# EasyEDA Pro project SICRO-Main_v2.epro

# Schematic SICRO-Main_v2
Create Date: 2023-11-26; Page Name: Main-board.SICRO-Main_v2; Project Name: LRIMa Agriculture Lite_2023-04-19_21-05-17; Schematic Name: SICRO-Main_v2; Update Date: 2024-01-04; Drawed: Nils Lahaye; Version: V1.0.0
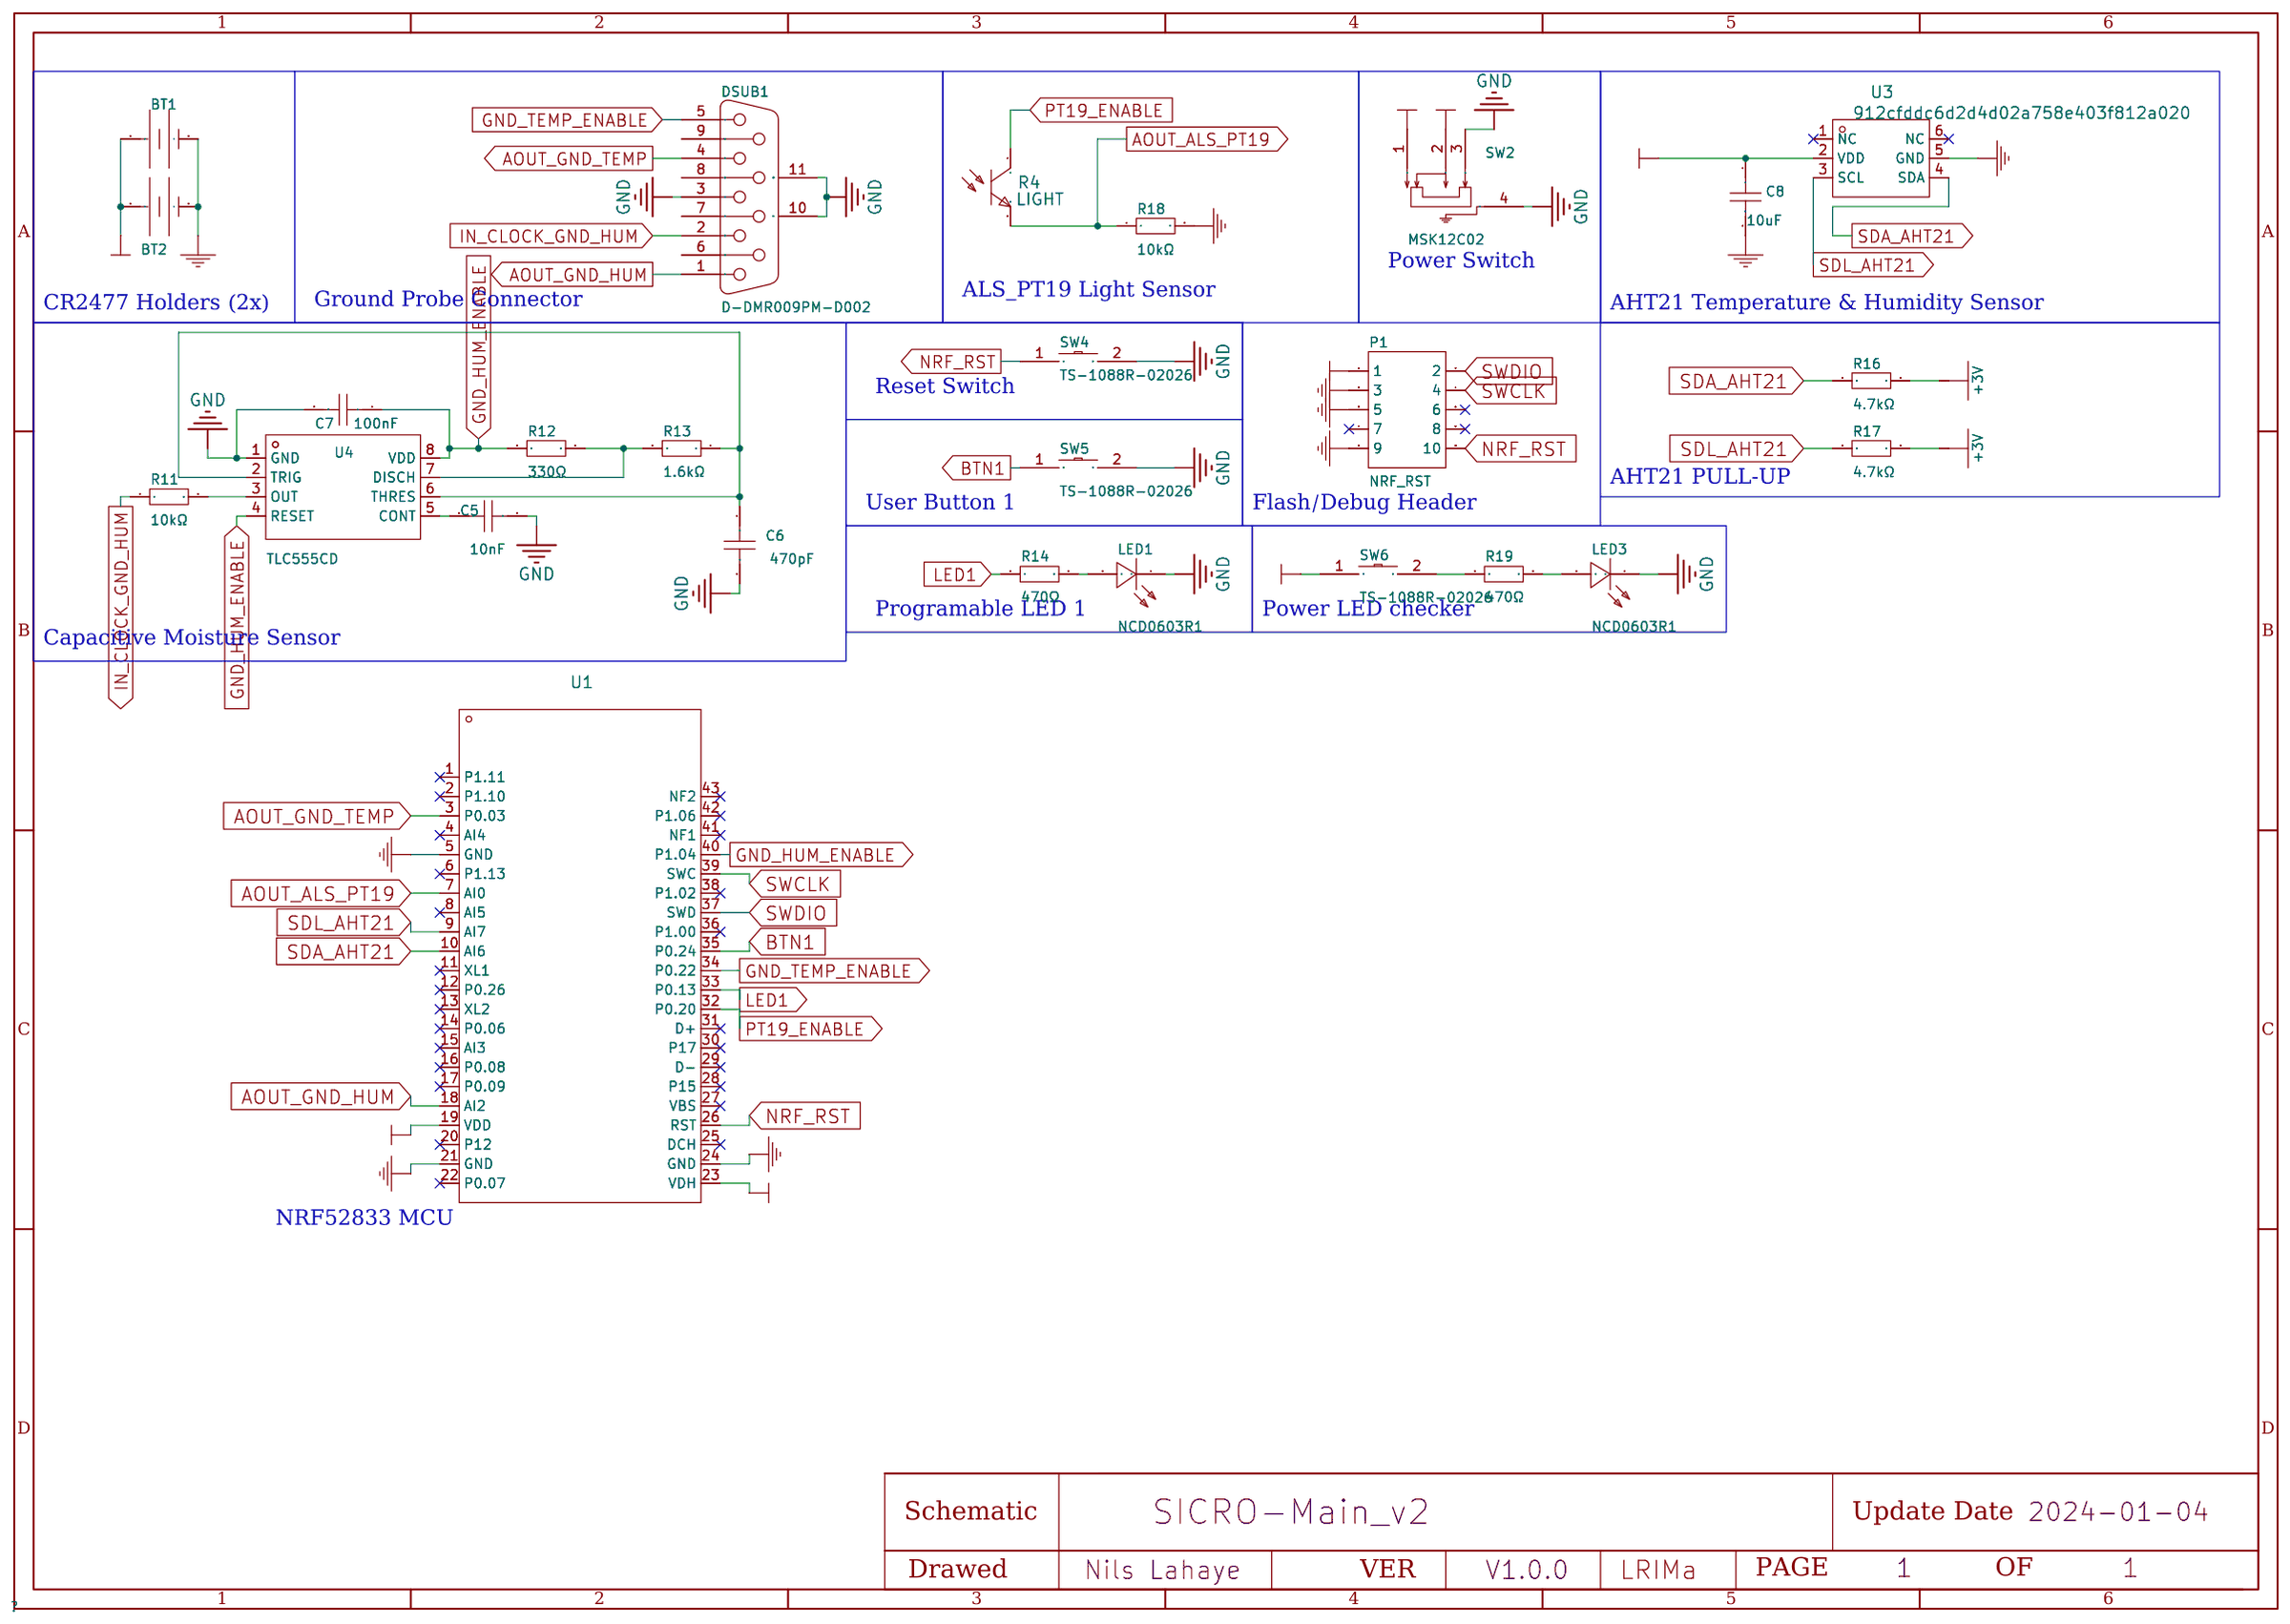
[diagram p0: schematic sheet]

## Parts
BT1  BS-24-A1AJ008  [BAT-TH_BS-24-A1AJ013]
BT2  BS-24-A1AJ008  [BAT-TH_BS-24-A1AJ013]
C5  10nF  [C0603]
C6  470pF  [C0603]
C7  100nF  [C0603]
C8  10uF  [C0603]
DSUB1  D-DMR009PM-D002  [DSUB-TH_DMR-9P]
LED1  NCD0603R1  [LED0603-RD_RED]
LED3  NCD0603R1  [LED0603-RD_RED]
P1  NRF_RST  [IDC-TH_10P-P2.54_C5665]
R4  LIGHT  [SENSORS-SMD_ALS-PT19]
R11  10kΩ  [R0603]
R12  330Ω  [R0603]
R13  1.6kΩ  [R0603]
R14  470Ω  [R0603]
R16  4.7kΩ  [R0603]
R17  4.7kΩ  [R0603]
R18  10kΩ  [R0603]
R19  470Ω  [R0603]
SW2  MSK12C02  [SW-TH_MSK12C02]
SW4  TS-1088R-02026  [SW-SMD_L3.9-W3.0-P4.45]
SW5  TS-1088R-02026  [SW-SMD_L3.9-W3.0-P4.45]
SW6  TS-1088R-02026  [SW-SMD_L3.9-W3.0-P4.45]
U1  NRF_RST  [SMD-43_L18.0-W13.0-P1.27-E73-2G4M08S1E]
U3  912cfddc6d2d4d02a758e403f812a020  [SENSOR-SMD_L3.0-W3.0-P1.00-BR]
U4  TLC555CD  [SOIC-8_L4.9-W3.9-P1.27-LS6.0-BL]

## Library data of the parts
BT1 BT2 = BS-24-A1AJ008: Connector Type:Battery base Battery Type:CR2477 Operating Temperature Range:-25℃~+85℃ Operating Temperature Range:-25℃~+85℃; LCSC Part Name: 电池底座 适用电池:CR2477; Supplier Part: C964814; Manufacturer: MYOUNG(美阳); Supplier Footprint: 插件; JLCPCB Part Class: Extended Part; Datasheet: https://atta.szlcsc.com/upload/public/pdf/source/20201218/C964814_551C7443D87E46DD8C4E7E69D648C1DE.pdf; Supplier: LCSC; Connector Type: Battery base; Battery Type: CR2477; Operating Temperature Range: -25℃~+85℃; Check: true
C5 = CC0603KRX7R9BB103: Capacitance: Tolerance:±10% Tolerance:±10% Voltage Rated: Temperature Coefficient:; LCSC Part Name: 10nF ±10% 50V; Supplier Part: C100042; Manufacturer: YAGEO(国巨); Supplier Footprint: 0603; JLCPCB Part Class: Extended Part; Datasheet: https://atta.szlcsc.com/upload/public/pdf/source/20180326/C100042_E8B0111D51DE3671A0A4A59FBCEFE81C.pdf; Supplier: LCSC; Tolerance: ±10%; Check: true
C6 = 0603B471K500NT: Capacitance: Tolerance:±10% Tolerance:±10% Voltage Rated: Temperature Coefficient:; LCSC Part Name: 470pF ±10% 50V; Supplier Part: C1620; Manufacturer: FH(风华); Supplier Footprint: 0603; JLCPCB Part Class: Basic Part; Datasheet: https://atta.szlcsc.com/upload/public/pdf/source/20170923/C1620_1506149295272988418.pdf; Supplier: LCSC; Tolerance: ±10%; Check: true
C7 = 0603B104K500NT_C30926: Capacitance: Tolerance:±10% Tolerance:±10% Voltage Rated: Temperature Coefficient:; LCSC Part Name: 100nF ±10% 50V; Supplier Part: C30926; Manufacturer: FH(风华); Manufacturer Part: 0603B104K500NT; Supplier Footprint: 0603; JLCPCB Part Class: Extended Part; Datasheet: https://atta.szlcsc.com/upload/public/pdf/source/20170923/C30926_1506149436298988724.pdf; Supplier: LCSC; Tolerance: ±10%; Check: true
C8 = CL10A106MQ8NNNC: Capacitance: Tolerance:±20% Tolerance:±20% Voltage Rated: Temperature Coefficient:; LCSC Part Name: 10uF ±20% 6.3V; Supplier Part: C1691; Manufacturer: SAMSUNG(三星); Supplier Footprint: 0603; JLCPCB Part Class: Extended Part; Datasheet: https://atta.szlcsc.com/upload/public/pdf/source/20160103/1457707690948.pdf; Supplier: LCSC; Tolerance: ±20%; Check: true
DSUB1 = D-DMR009PM-D002: Connector Type:D-Sub Gender:公 Number of Pins:9 Number of Rows:2 Mounting Style:Shrouded Current Rating (Max):3A Operating Temperature Range:-50℃~+105℃ Operating Temperature Range:-50℃~+105℃; LCSC Part Name: D-Sub 公 P数:9 DMR叉锁 半金; Supplier Part: C141880; Manufacturer: Ckmtw(灿科盟); Supplier Footprint: 插件; JLCPCB Part Class: Extended Part; Datasheet: https://atta.szlcsc.com/upload/public/pdf/source/20171123/C141880_15114109678101137623.pdf; Supplier: LCSC; Connector Type: D-Sub; Gender: 公; Number of Pins: 9; Number of Rows: 2; Mounting Style: Shrouded; Current Rating (Max): 3A; Operating Temperature Range: -50℃~+105℃; Check: true
LED1 LED3 = NCD0603R1_C84263: Emitted Color:红灯; LCSC Part Name: 红灯; Supplier Part: C84263; Manufacturer: 国星光电; Supplier Footprint: 0603; JLCPCB Part Class: Extended Part; Datasheet: https://atta.szlcsc.com/upload/public/pdf/source/20200820/C84263_DABC6A75E58F576973B407FDBA283D60.pdf; Supplier: LCSC; Emitted Color: 红灯; Operating Temperature: -40℃~+85℃; Check: true
P1 = 2.54-2*5P简牛: Connector Type:简牛座 Pin Number in each Row:5 Number of Rows:2 Pitch:2.54mm Row Spacing:2.54mm Holder Type:Straight Contact Material:- Contact Plating:-; LCSC Part Name: 每排P数:5 排数:2 2.54mm; Supplier Part: C5665; Manufacturer: BOOMELE(博穆精密); Supplier Footprint: 插件,P=2.54mm; JLCPCB Part Class: Extended Part; Datasheet: https://atta.szlcsc.com/upload/public/pdf/source/20140331/1457707037896.pdf; Supplier: LCSC; Connector Type: 简牛座; Pin Number in each Row: 5; Number of Rows: 2; Pitch: 2.54mm; Row Spacing: 2.54mm; Holder Type: Straight; Check: true
R4 = ALS-PT19-315C/L177/TR8: Supplier: LCSC; Manufacturer: EVERLIGHT(亿光); Supplier Part: C146233; JLCPCB Part Class: Extended Part; Check: true
R11 R18 = 0603WAF1002T5E: Type:Thick Film Resistors Resistance: Tolerance:±1% Tolerance:±1% Power(Watts): Temperature Coefficient:±100ppm/℃ Temperature Coefficient:±100ppm/℃ Overload Voltage (Max): Operating Temperature Range:-55℃~+155℃ Operating Temperature Range:-55℃~+155℃; LCSC Part Name: 厚膜电阻 10kΩ ±1% 100mW; Supplier Part: C25804; Manufacturer: UNI-ROYAL(厚声); Supplier Footprint: 0603; JLCPCB Part Class: Basic Part; Datasheet: https://atta.szlcsc.com/upload/public/pdf/source/20200306/C422600_1E6D84923E4A46A82E41ADD87F860B5C.pdf; Supplier: LCSC; Type: Thick Film Resistors; Tolerance: ±1%; Temperature Coefficient: ±100ppm/℃; Operating Temperature Range: -55℃~+155℃; Check: true
R12 = SCR0603F330R: Resistance: Tolerance:±1% Tolerance:±1%; LCSC Part Name: 330Ω ±1%; Supplier Part: C3016255; Manufacturer: VO(翔胜); Supplier Footprint: 0603; JLCPCB Part Class: Extended Part; Datasheet: https://atta.szlcsc.com/upload/public/pdf/source/20220513/247AF9639BA21CF93567DC289CCC6A22.pdf; Supplier: LCSC; Tolerance: ±1%; Check: true
R13 = 0603WAF1601T5E: Type:Thick Film Resistors Resistance: Tolerance:±1% Tolerance:±1% Power(Watts): Temperature Coefficient:±100ppm/℃ Temperature Coefficient:±100ppm/℃ Overload Voltage (Max): Operating Temperature Range:-55℃~+155℃ Operating Temperature Range:-55℃~+155℃; LCSC Part Name: 1.6kΩ ±1% 100mW; Supplier Part: C22847; Manufacturer: UNI-ROYAL(厚声); Supplier Footprint: 0603; JLCPCB Part Class: Extended Part; Datasheet: https://atta.szlcsc.com/upload/public/pdf/source/20200306/C422600_1E6D84923E4A46A82E41ADD87F860B5C.pdf; Supplier: LCSC; Type: Thick Film Resistors; Tolerance: ±1%; Temperature Coefficient: ±100ppm/℃; Operating Temperature Range: -55℃~+155℃; Check: true
R14 R19 = 0603WAF4700T5E: Type:Thick Film Resistors Resistance: Tolerance:±1% Tolerance:±1% Power(Watts): Temperature Coefficient:±100ppm/℃ Temperature Coefficient:±100ppm/℃ Overload Voltage (Max): Operating Temperature Range:-55℃~+155℃ Operating Temperature Range:-55℃~+155℃; LCSC Part Name: 470Ω ±1% 100mW; Supplier Part: C23179; Manufacturer: UNI-ROYAL(厚声); Supplier Footprint: 0603; JLCPCB Part Class: Basic Part; Datasheet: https://atta.szlcsc.com/upload/public/pdf/source/20200306/C422600_1E6D84923E4A46A82E41ADD87F860B5C.pdf; Supplier: LCSC; Type: Thick Film Resistors; Tolerance: ±1%; Temperature Coefficient: ±100ppm/℃; Operating Temperature Range: -55℃~+155℃; Check: true
R16 R17 = FRC0603J472 TS: Type:Thick Film Resistors Resistance: Tolerance:±5% Tolerance:±5% Power(Watts): Temperature Coefficient:±100ppm/℃ Temperature Coefficient:±100ppm/℃ Overload Voltage (Max): Operating Temperature Range:-55℃~+155℃ Operating Temperature Range:-55℃~+155℃; LCSC Part Name: 4.7kΩ ±5% 100mW; Supplier Part: C2907166; Manufacturer: FOJAN(富捷); Supplier Footprint: 0603; JLCPCB Part Class: Extended Part; Datasheet: https://atta.szlcsc.com/upload/public/pdf/source/20211102/08480A48F159CF742D398A1E4DC90941.pdf; Supplier: LCSC; Type: Thick Film Resistors; Tolerance: ±5%; Temperature Coefficient: ±100ppm/℃; Operating Temperature Range: -55℃~+155℃; Check: true
SW2 = MSK12C02: LCSC Part Name: 两档侧拨贴片 7脚 拨动 白柄 柄长1.5mm,带定位柱; Supplier Part: C431540; Manufacturer: SHOU HAN(首韩); Supplier Footprint: SMD; JLCPCB Part Class: Extended Part; Supplier: LCSC; Check: true
SW4-SW6 = TS-1088R-02026: Contact Current:50mA Voltage Rating (DC):12V Circuit:SPST Mounting Style:Brick nogging Actuator Style:Round Button With Lamp:- Mechanical Life:- Switch Length:3.9mm Switch Width:2.93mm Switch Height:2mm; LCSC Part Name: 3.9*2.93*2mm 立贴 轻触开关; Supplier Part: C318938; Manufacturer: XUNPU(讯普); Supplier Footprint: SMD,3x4mm; JLCPCB Part Class: Extended Part; Datasheet: https://atta.szlcsc.com/upload/public/pdf/source/20191118/C455280_718CC4284DAF75EEB0AC8229AE7E40C5.pdf; Supplier: LCSC; Contact Current: 50mA; Voltage Rating (DC): 12V; Circuit: SPST; Mounting Style: Brick nogging; Actuator Style: Round Button; Switch Length: 3.9mm; Switch Width: 2.93mm; Switch Height: 2mm; Actuator/Cap Color: 白色带淡绿; Operating Force: 260gf; Operating Temperature: -30℃~+85℃; Strike Gundam: NO; Check: true
U1 = E73-2G4M08S1E: Supplier: LCSC; Supplier Part: C2845026; Manufacturer: null; JLCPCB Part Class: Extended Part; Check: true
U3 = AHT21: Supplier: LCSC; Supplier Part: C2827328; Manufacturer: 广州奥松; JLCPCB Part Class: Extended Part; Check: true
U4 = TLC555CD: Supply Voltage:2V~15V Supply Voltage:2V~15V Supply Current:360uA Operating Temperature:0℃~+70℃ Operating Temperature:0℃~+70℃; LCSC Part Name: 2V~15V; Supplier Part: C1520195; Manufacturer: TI(德州仪器); Supplier Footprint: SOIC-8; JLCPCB Part Class: Extended Part; Datasheet: https://atta.szlcsc.com/upload/public/pdf/source/20230221/BE785C34ED0C575E6FD643CACC9A1BDA.pdf; Supplier: LCSC; Supply Voltage: 2V~15V; Supply Current: 360uA; Operating Temperature: 0℃~+70℃; Check: true

## Nets
+3V: C8.1 P1.1 R16.2 R17.2 SW2.2 SW6.1 U1.19(VDD) U1.23(VDH) U3.2(VDD)
+3V_S: BT1.1(+) BT2.1(+) SW2.1
GND: BT1.2(-) BT2.2(-) C5.1 C6.2 C7.2 C8.2 DSUB1.3 DSUB1.10(MH1) DSUB1.11(MH2) LED1.1(K) LED3.1(K) P1.3 P1.5 P1.9 R18.2 SW2.3 SW2.4 SW4.2 SW5.2 U1.5(GND) U1.21(GND) U1.24(GND) U3.5(GND) U4.1(GND)
GND_HUM_ENABLE: C7.1 R12.2 U1.40(P1.04) U4.4(RESET) U4.8(VDD)
GND_TEMP_ENABLE: DSUB1.5 U1.34(P0.22)
AOUT_ALS_PT19: R4.2 R18.1 U1.7(AI0)
AOUT_GND_HUM: DSUB1.1 U1.18(AI2)
AOUT_GND_TEMP: DSUB1.4 U1.3(P0.03)
BTN1: SW5.1 U1.35(P0.24)
IN_CLOCK_GND_HUM: DSUB1.2 R11.1
LED1: R14.1 U1.33(P0.13)
NRF_RST: P1.10 SW4.1 U1.26(RST)
PT19_ENABLE: R4.1 U1.32(P0.20)
SDA_AHT21: R16.1 U1.10(AI6) U3.4(SDA)
SDL_AHT21: R17.1 U1.9(AI7) U3.3(SCL)
SWCLK: P1.4 U1.39(SWC)
SWDIO: P1.2 U1.37(SWD)
$1N17890: C5.2 U4.5(CONT)
$1N18073: R12.1 R13.2 U4.7(DISCH)
$1N18188: R11.2 U4.3(OUT)
$1N18552: C6.1 R13.1 U4.2(TRIG) U4.6(THRES)
$1N21950: LED1.2(A) R14.2
$1N44585: R19.1 SW6.2
$1N44588: LED3.2(A) R19.2

Not connected (* = marked no-connect by the designer): DSUB1 6 7 8 9; P1 6* 7* 8*; U1 1(P1.11)* 2(P1.10)* 4(AI4)* 6(P1.13)* 8(AI5)* 11(XL1)* 12(P0.26)* 13(XL2)* 14(P0.06)* 15(AI3)* 16(P0.08)* 17(P0.09)* 20(P12)* 22(P0.07)* 25(DCH)* 27(VBS)* 28(P15)* 29(D-)* 30(P17)* 31(D+)* 36(P1.00)* 38(P1.02)* 41(NF1)* 42(P1.06)* 43(NF2)*; U3 1(NC)* 6(NC)*

## Notes on the sheet
- Power Switch
- CR2477 Holders (2x)
- Ground Probe Connector
- ALS_PT19 Light Sensor
- AHT21 Temperature & Humidity Sensor
- Reset Switch
- AHT21 PULL-UP
- User Button 1
- Flash/Debug Header
- Programable LED 1
- Power LED checker
- Capacitive Moisture Sensor
- NRF52833 MCU

# Board SICRO-Main-PCB_v2
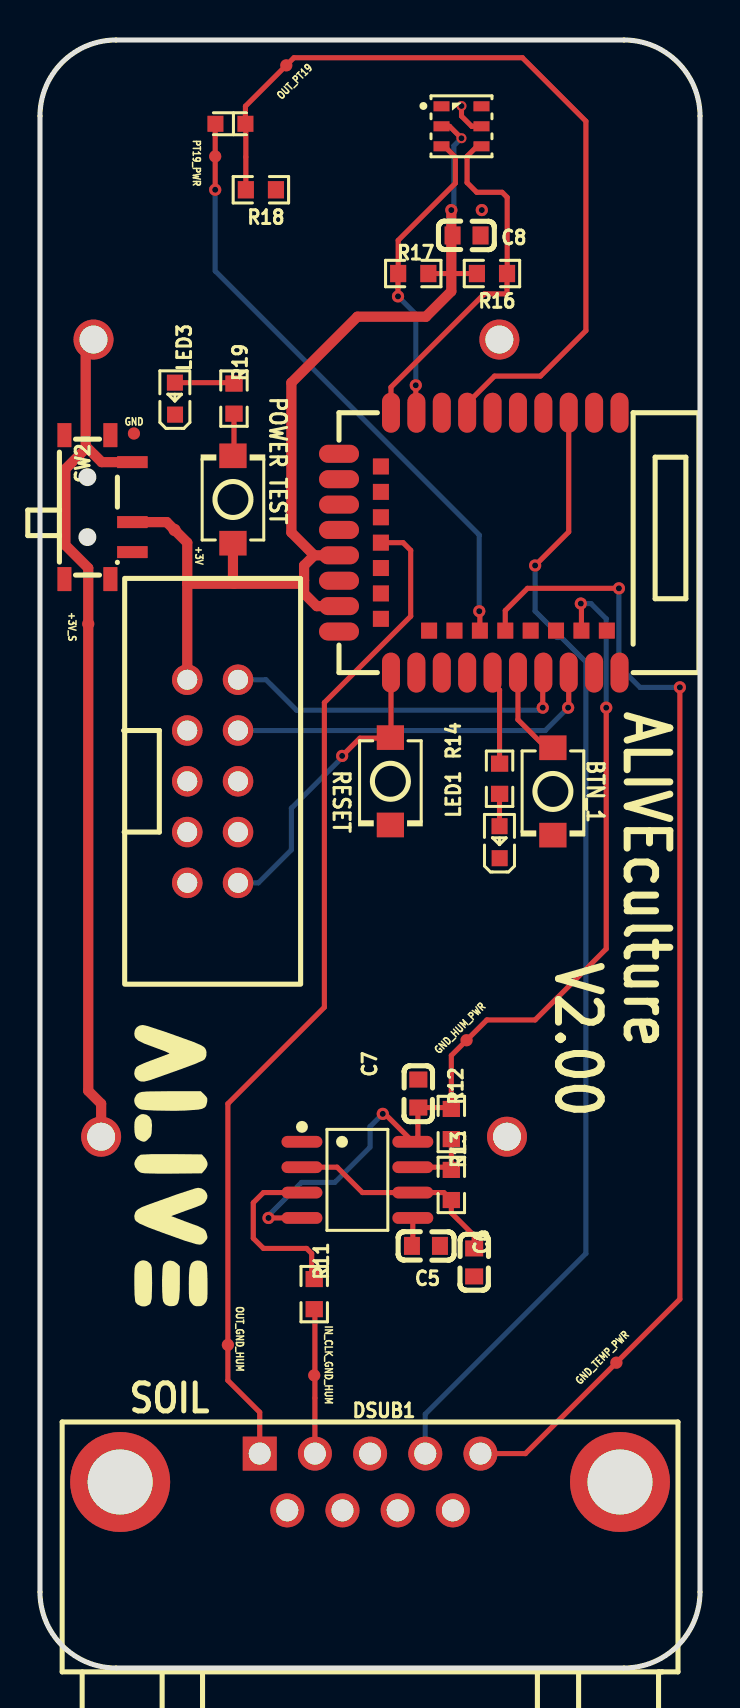
[diagram p1: board, top side]
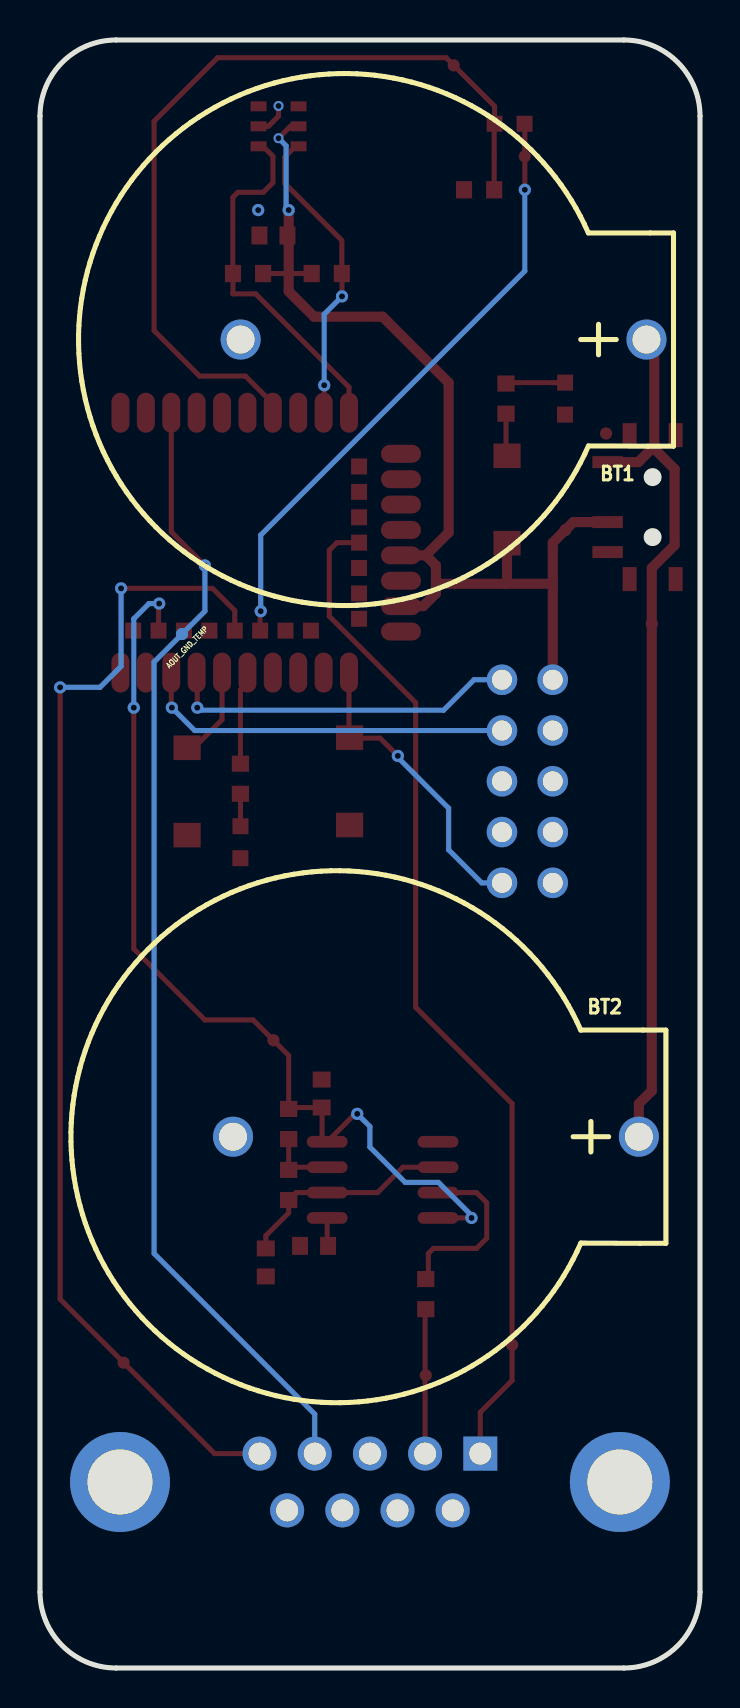
[diagram p2: board, bottom side, seen from below]

Outline 33.01 x 81.44 mm; copper layers: Top Layer, Bottom Layer. Coordinates in mm from the lower left corner of the outline.
Outline path: 0,77.63 0,3.81 arc(1.12,1.12) 3.81,0 29.2,0 arc(31.9,1.12) 33.01,3.81 33.01,77.63 arc(31.9,80.33) 29.2,81.44 3.81,81.44 arc(1.12,80.33) 0,77.63
Stack: Top Layer 0.035mm / Dielectric1 1.51mm FR4 er 4.5 / Bottom Layer 0.035mm

## Design rules (mm)
spacing safeClearance (default): track to track 0.254, other pairs 0.254 to 0.3
track width trackWidth (default): min 0.127, default 0.254, max 2.54
differential pair differentialPair (default): width min 0.127, default 0.254, max 2.54; gap min 0.152, default 0.152
via viaSize (default): diameter min 0.5, default 0.61, max 10; hole min 0.3, default 0.305, max 6

## Placement (name value [footprint] x y rotation side)
BT1  BS-24-A1AJ008  [BAT-TH_BS-24-A1AJ013]  12.83 66.46 180 bottom
BT2  BS-24-A1AJ008  [BAT-TH_BS-24-A1AJ013]  13.21 26.58 180 bottom
C5  10nF  [C0603]  19.3 21.12 180 top
C6  470pF  [c0603]  21.72 20.29 270 top
C7  100nF  [C0603]  18.92 28.74 90 top
C8  10uF  [C0603]  21.34 71.66 0 top
DSUB1  D-DMR009PM-D002  [DSUB-TH_DMR-9P]  16.51 9.31 270 top
LED1  NCD0603R1  [LED0603-RD_RED]  22.99 41.31 90 top
LED3  NCD0603R1  [LED0603-RD_RED]  6.75 63.5 90 top
NOREF  -  [Pad_e1228]  6.73 56.93 0 top
NOREF#2  -  [Pad_e1235]  12.32 80.17 0 top
NOREF#3  -  [Pad_e1253]  9.4 16.16 0 top
NOREF#4  -  [Pad_e1741]  4.7 61.76 0 top
NOREF#5  -  [Pad_e1391]  2.41 52.23 0 top
NOREF#6  -  [Pad_e1247]  13.72 14.64 0 top
NOREF#7  -  [Pad_e1259]  28.83 15.28 0 top
NOREF#8  -  [Pad_e1241]  21.34 31.4 0 top
NOREF#9  -  [Pad_e1398]  25.91 51.72 0 top
NOREF#10  -  [Pad_e1229]  8.76 75.62 0 top
P1  NRF_RST  [IDC-TH_10P-P2.54_C5665]  8.64 44.36 270 top
R1  LIGHT  [SENSORS-SMD_ALS-PT19]  9.53 77.25 0 top
R11  10kΩ  [R0603]  13.72 18.7 90 top
R12  330Ω  [R0603]  20.57 27.21 90 top
R13  1.6kΩ  [R0603]  20.57 24.17 90 top
R14  470Ω  [R0603]  22.99 44.49 270 top
R16  4.7kΩ  [R0603]  22.61 69.76 180 top
R17  4.7kΩ  [R0603]  18.67 69.76 0 top
R18  10kΩ  [R0603]  11.05 73.95 0 top
R19  470Ω  [R0603]  9.7 63.5 90 top
SW2  MSK12C02  [SW-TH_MSK12C02]  2.92 58.07 270 top
SW4  TS-1088R-02026  [SW-SMD_L3.9-W3.0-P4.45]  17.53 44.36 270 top
SW5  TS-1088R-02026  [SW-SMD_L3.9-W3.0-P4.45]  25.65 43.85 270 top
SW6  TS-1088R-02026  [SW-SMD_L3.9-W3.0-P4.45]  9.65 58.46 90 top
U1  NRF_RST  [SMD-43_L18.0-W13.0-P1.27-E73-2G4M08S1E]  21.97 56.3 90 top
U3  912cfddc6d2d4d02a758e403f812a020  [SENSOR-SMD_L3.0-W3.0-P1.00-BR]  21.08 77.12 180 top
U4  TLC555CD  [SOIC-8_L4.9-W3.9-P1.27-LS6.0-BL]  15.88 24.42 270 top

## Footprints (pads in the part's own frame, mm; a bottom-side part is the same pattern mirrored in y, then rotated)
BAT-TH_BS-24-A1AJ013
  round 2 hole 1.4: 1(10.15,0) 2(-10.15,0)
c0603
  rect 0.8x0.9 smd: 1(-0.7,0) 2(0.7,0)
C0603
  rect 0.8x0.9 smd: 1(-0.7,0) 2(0.7,0)
DSUB-TH_DMR-9P
  rect 1.7x1.7 hole 1.1: 1(-1.42,-5.52)
  round 1.7 hole 1.1: 2(-1.42,-2.76) 3(-1.42,0) 4(-1.42,2.76) 5(-1.42,5.52) 6(1.42,-4.14) 7(1.42,-1.38) 8(1.42,1.38) 9(1.42,4.14)
  round 5 hole 3.25: 10(0,12.5) 11(0,-12.5)
IDC-TH_10P-P2.54_C5665
  round 1.524 hole 1: 1(-5.08,-1.27) 2(-5.08,1.27) 3(-2.54,-1.27) 4(-2.54,1.27) 5(0,-1.27) 6(0,1.27) 7(2.54,-1.27) 8(2.54,1.27) 9(5.08,-1.27) 10(5.08,1.27)
LED0603-RD_RED
  rect 0.8x0.8 smd: 1(-0.799,-0.004) 2(0.799,0.004)
Pad_e1228
  round 0.61 smd: TP1(0,0)
Pad_e1229
  round 0.61 smd: TP2(0,0)
Pad_e1235
  round 0.61 smd: TP3(0,0)
Pad_e1241
  round 0.61 smd: TP4(0,0)
Pad_e1247
  round 0.61 smd: TP5(0,0)
Pad_e1253
  round 0.61 smd: TP6(0,0)
Pad_e1259
  round 0.61 smd: TP7(0,0)
Pad_e1391
  round 0.61 smd: TP9(0,0)
Pad_e1398
  round 0.61 smd far side: TP11(0,0)
Pad_e1741
  round 0.61 smd: TP13(0,0)
R0603
  rect 0.806x0.864 smd: 1(-0.753,0) 2(0.753,0)
SENSOR-SMD_L3.0-W3.0-P1.00-BR
  rect 0.8x0.5 smd: 1(1,-1) 2(1,0) 3(1,1) 4(-1,1) 5(-1,0) 6(-1,-1)
SENSORS-SMD_ALS-PT19
  rect 0.8x0.8 smd: 1(-0.75,0) 2(0.75,0)
SMD-43_L18.0-W13.0-P1.27-E73-2G4M08S1E
  oval 2x0.9 smd: 1(6.5,-7.015) 2(6.5,-5.745) 3(6.5,-4.475) 4(6.5,-3.205) 5(6.5,-1.935) 6(6.5,-0.665) 7(6.5,0.605) 8(6.5,1.875) 9(6.5,3.145) 10(6.5,4.415) 26(-6.5,4.415) 27(-6.5,3.145) 29(-6.5,1.875) 31(-6.5,0.605) 33(-6.5,-0.665) 35(-6.5,-1.935) 37(-6.5,-3.205) 39(-6.5,-4.475) 41(-6.5,-5.745) 43(-6.5,-7.015)
  oval 0.9x2 smd: 11(4.445,7.015) 13(3.175,7.015) 15(1.905,7.015) 17(0.635,7.015) 19(-0.635,7.015) 21(-1.905,7.015) 23(-3.175,7.015) 25(-4.445,7.015)
  rect 0.8x0.8 smd: 12(3.81,4.92) 14(2.54,4.92) 16(1.27,4.92) 18(0,4.92) 20(-1.27,4.92) 22(-2.54,4.92) 24(-3.81,4.92) 28(-4.4,2.51) 30(-4.4,1.24) 32(-4.4,-0.03) 34(-4.4,-1.3) 36(-4.4,-2.57) 38(-4.4,-3.84) 40(-4.4,-5.11) 42(-4.4,-6.38)
SOIC-8_L4.9-W3.9-P1.27-LS6.0-BL
  oval 0.588x2.045 smd: 1(-1.905,-2.772) 2(-0.635,-2.772) 3(0.635,-2.772) 4(1.905,-2.772) 5(1.905,2.772) 6(0.635,2.772) 7(-0.635,2.772) 8(-1.905,2.772)
SW-SMD_L3.9-W3.0-P4.45
  rect 1.23x1.36 smd: 1(-2.185,0) 2(2.185,0)
SW-TH_MSK12C02
  rect 0.6x1.524 smd: 1(-2.25,1.7) 2(0.75,1.7) 3(2.25,1.7)
  rect 1.2x0.7 smd: 4(-3.6,0.6) 4(-3.6,-1.7) 4(3.6,0.6) 4(3.6,-1.7)

## Nets
+3V: C8.1 NOREF.TP1 P1.1 R16.2 R17.2 SW2.2 SW6.1 U1.19 U1.23 U3.2
+3V_S: BT1.1 BT2.1 NOREF#5.TP9 SW2.1
GND: BT1.2 BT2.2 C5.1 C6.2 C7.2 C8.2 DSUB1.3 DSUB1.10 DSUB1.11 LED1.1 LED3.1 NOREF#4.TP13 P1.3 P1.5 P1.9 R18.2 SW2.3 SW2.4 SW4.2 SW5.2 U1.5 U1.21 U1.24 U3.5 U4.1
GND_HUM_ENABLE: C7.1 NOREF#8.TP4 R12.2 U1.40 U4.4 U4.8
GND_TEMP_ENABLE: DSUB1.5 NOREF#7.TP7 U1.34
AOUT_ALS_PT19: NOREF#2.TP3 R1.2 R18.1 U1.7
AOUT_GND_HUM: DSUB1.1 NOREF#3.TP6 U1.18
AOUT_GND_TEMP: DSUB1.4 NOREF#9.TP11 U1.3
BTN1: SW5.1 U1.35
IN_CLOCK_GND_HUM: DSUB1.2 NOREF#6.TP5 R11.1
LED1: R14.1 U1.33
NRF_RST: P1.10 SW4.1 U1.26
PT19_ENABLE: NOREF#10.TP2 R1.1 U1.32
SDA_AHT21: R16.1 U1.10 U3.4
SDL_AHT21: R17.1 U1.9 U3.3
SWCLK: P1.4 U1.39
SWDIO: P1.2 U1.37
$1N17890: C5.2 U4.5
$1N18073: R12.1 R13.2 U4.7
$1N18188: R11.2 U4.3
$1N18552: C6.1 R13.1 U4.2 U4.6
$1N21950: LED1.2 R14.2
$1N44585: R19.1 SW6.2
$1N44588: LED3.2 R19.2

Pads without a net: DSUB1 6 7 8 9; P1 6 7 8; U1 1 2 4 6 8 11 12 13 14 15 16 17 20 22 25 27 28 29 30 31 36 38 41 42 43; U3 1 6

## Via types
v1: diameter 0.61, hole 0.305, Top Layer to Bottom Layer, 16 vias
v2: diameter 0.5, hole 0.3, Top Layer to Bottom Layer, 2 vias

## Routing (per net, layer and track width the routed paths; a pad name or vN(x,y) marks a point on that pad's centre or on a via; arc(x,y) is an arc through that point)
+3V: length 53.7
  Top Layer w0.254: R17.2 R16.2 21.98,69.89 ; U3.2 20.48,77.12 v2(21.08,76.53)
  Top Layer w0.508: 9.7,54.24 9.65,54.29 9.65,55.85 ; 9.7,54.24 13.03,54.24 13.21,54.42 ; 9.7,54.24 7.37,54.24 ; 13.72,55.66 13.21,55.15 13.21,54.42 ; 13.72,55.66 U1.19 ; 13.72,55.66 12.57,56.8 12.57,64.3 15.88,67.6 19.3,67.6 20.57,68.87 20.57,69.75 ; 7.37,54.24 P1.1 ; 7.37,54.24 7.37,56.3 NOREF.TP1 6.34,57.32 SW2.2 ; 20.57,72.93 20.57,69.76 ; U1.23 13.84,53.12 13.21,53.76 13.21,54.42
  Bottom Layer w0.254: v2(21.08,76.53) 20.7,76.15 20.7,73.06 v1(20.57,72.93)
+3V_S: length 43.9
  Top Layer w0.508: 2.29,61.12 2.29,66.07 BT1.1 ; 2.29,61.12 2.29,61 1.27,59.98 1.27,56.17 2.41,55.03 NOREF#5.TP9 2.41,28.87 3.06,28.23 BT2.1 ; 2.29,61.12 3.08,60.32 SW2.1
GND: length 1.7
  Top Layer w0.254: U3.5 21.59,77.12 21.08,77.63 21.08,78.14
  vias: v1(22.1,72.93) v2(21.08,78.14)
GND_HUM_ENABLE: length 47.9
  Top Layer w0.254: v1(17.15,27.72) 17.25,27.72 U4.8 18.9,26.58 18.9,28.02 C7.1 20.5,28.04 R12.2 20.57,30.64 NOREF#8.TP4 22.35,32.42 24.76,32.42 28.32,35.98 v1(28.32,48.04) ; 27.08,51.9 27.08,53.22 v1(27.05,53.25) ; v1(11.43,22.51) U4.4
  Bottom Layer w0.254: v1(27.05,53.25) 27.56,53.25 28.32,52.49 v1(28.32,48.04) ; v1(17.15,27.72) 16.51,27.09 16.51,26.06 14.74,24.29 13.08,24.29 11.43,22.64 v1(11.43,22.51)
GND_TEMP_ENABLE: length 58.3
  Top Layer w0.254: v1(28.96,54.01) 24.38,54.01 23.27,52.9 23.27,51.9 ; DSUB1.5 24.28,10.73 NOREF#7.TP7 32,18.45 v1(32,49.06)
  Bottom Layer w0.254: v1(28.96,54.01) 28.96,50.11 30.01,49.06 v1(32,49.06)
AOUT_ALS_PT19: length 41.9
  Top Layer w0.254: U1.7 21.37,63.26 22.73,64.63 25.03,64.63 27.31,66.9 27.31,77.38 24.13,80.55 12.7,80.55 NOREF#2.TP3 10.28,78.13 R1.2 10.3,77.23 R18.1
AOUT_GND_HUM: length 51.3
  Top Layer w0.254: DSUB1.1 10.99,12.79 9.4,14.39 NOREF#3.TP6 9.4,28.23 14.22,33.06 14.22,48.3 18.54,52.61 18.54,55.92 18.16,56.3 U1.18
AOUT_GND_TEMP: length 57.1
  Top Layer w0.254: v1(24.76,55.15) 26.45,56.83 U1.3
  Bottom Layer w0.254: v1(24.76,55.15) 24.76,52.87 NOREF#9.TP11 27.31,50.33 27.31,20.74 19.27,12.7 DSUB1.4
BTN1: length 5.2
  Top Layer w0.254: SW5.1 25.65,45.69 23.91,47.44 U1.35
IN_CLOCK_GND_HUM: length 7.2
  Top Layer w0.254: DSUB1.2 13.75,17.92 R11.1
LED1: length 4.7
  Top Layer w0.254: R14.1 22.99,48.92 22.73,49.18 22.73,49.53 22.64,49.63 U1.33
NRF_RST: length 15.2
  Top Layer w0.254: U1.26 17.56,46.55 17.53,46.52 16,46.52 v1(15.11,45.63)
  Bottom Layer w0.254: v1(15.11,45.63) 15.11,45.55 12.57,43.01 12.57,40.93 10.92,39.28 9.91,39.28
PT19_ENABLE: length 30.8
  Top Layer w0.254: v1(8.76,73.95) NOREF#10.TP2 8.76,77.24 R1.1 ; v1(21.97,52.87) 22,52.84 22,51.9
  Bottom Layer w0.254: v1(21.97,52.87) 21.97,56.68 8.76,69.89 v1(8.76,73.95)
SDA_AHT21: length 18.4
  Top Layer w0.254: U1.10 17.56,64.07 22.22,68.74 23.37,68.74 23.36,68.75 R16.1 23.37,69.77 23.37,73.57 23.11,73.82 21.84,73.82 21.36,74.31 21.36,75.63 21.86,76.12 U3.4
SDL_AHT21: length 15.3
  Top Layer w0.254: U3.3 20.23,76.12 20.78,75.58 20.78,74.28 17.92,71.42 R17.1 17.91,69.75 v1(17.91,68.62) ; v1(18.8,64.17) 18.8,62.83 U1.9
  Bottom Layer w0.254: v1(18.8,64.17) 18.8,67.73 v1(17.91,68.62)
SWCLK: length 18.8
  Top Layer w0.254: v1(26.42,48.04) 26.45,48.07 U1.39
  Bottom Layer w0.254: 9.91,46.9 25.27,46.9 v1(26.42,48.04)
SWDIO: length 17.7
  Top Layer w0.254: U1.37 25.15,49.77 v1(25.15,48.04)
  Bottom Layer w0.254: P1.2 11.3,49.44 12.83,47.91 25.02,47.91 v1(25.15,48.04)
$1N17890: length 1.4
  Top Layer w0.254: U4.5 18.65,21.16 C5.2
$1N18073: length 3.5
  Top Layer w0.254: R12.1 R13.2 20.44,25.05 U4.7
$1N18188: length 8.9
  Top Layer w0.254: U4.3 11.18,23.78 10.67,23.28 10.67,21.5 11.18,20.99 13.34,20.99 13.59,20.74 13.59,19.46
$1N18552: length 11
  Top Layer w0.254: C6.1 21.72,21.63 20.57,22.77 R13.1 20.2,23.78 U4.6 16.13,23.78 14.86,25.05 U4.2
$1N21950: length 1.7
  Top Layer w0.254: LED1.2 22.98,43.51 23.11,43.64 23.02,43.73 R14.2
$1N44585: length 2
  Top Layer w0.254: R19.1 9.7,60.73
$1N44588: length 3
  Top Layer w0.254: 9.7,64.25 9.66,64.3 LED3.2

## Copper pours and planes (outline as drawn; the poured copper is in the pictures)
GND on Top Layer: 0,81.32 33.01,81.32 33.01,-0.25 0,-0.25
GND on Bottom Layer: 0,81.44 33.01,81.44 33.01,-0.25 0,-0.25

## Text on the board
Bottom Silkscreen Layer: AOUT_GND_TEMP
Top Silkscreen Layer: GND | OUT_PT19 | GND_HUM_PWR | GND_TEMP_PWR | +3V_S | PT19_PWR | +3V | OUT_GND_HUM | IN_CLK_GND_HUM | RESET | BTN_1 | POWER TEST | SOIL | ALIVEculture / V2.00
